# EAGLE design esp32_uart_co2_sensor (EAGLE 9.6.2)
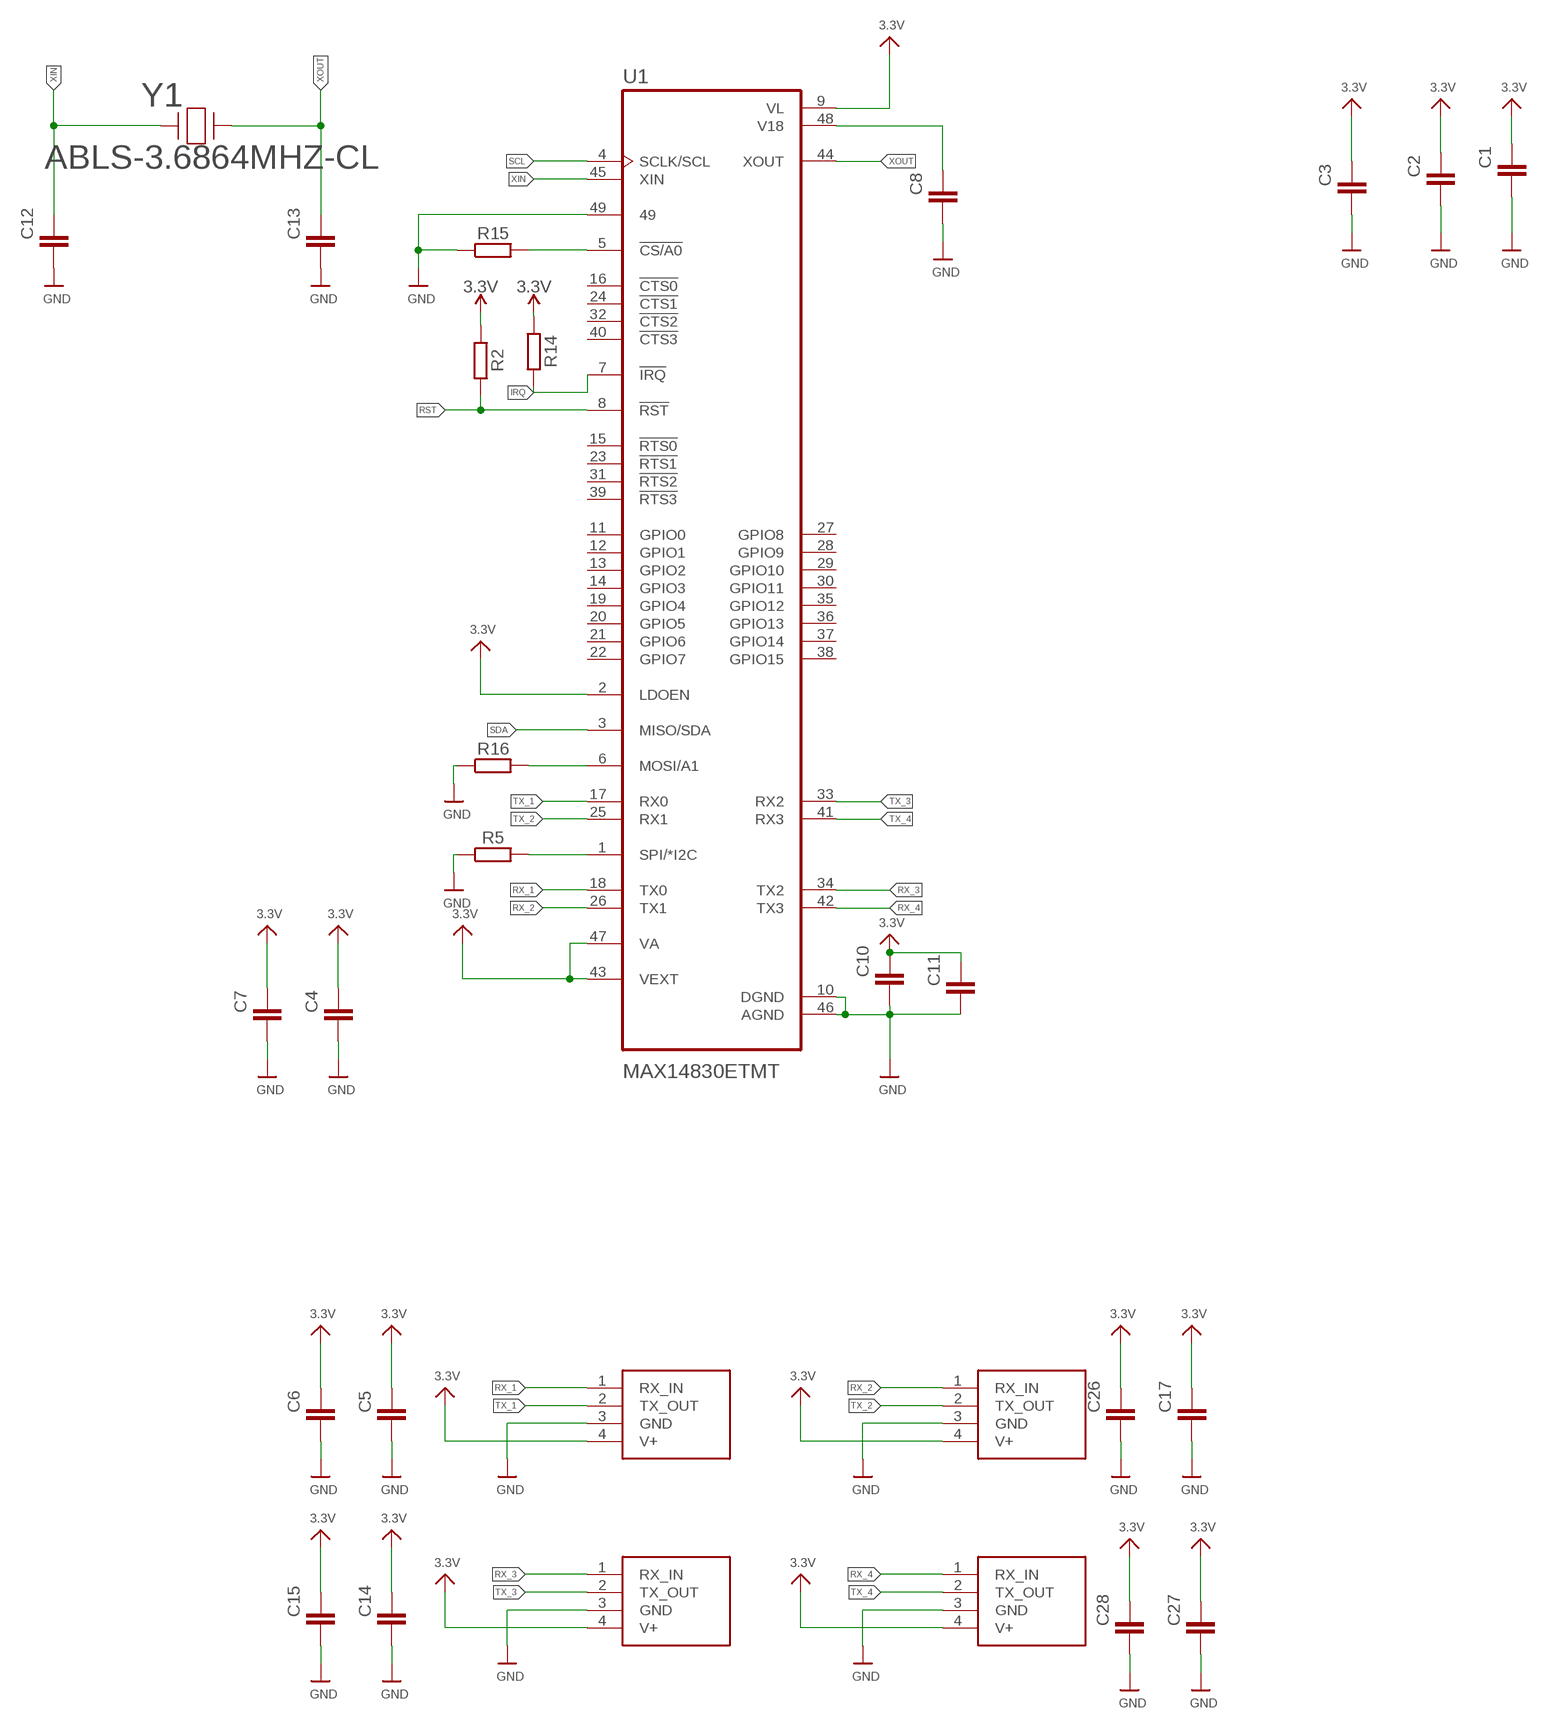
[diagram p0: schematic, sheet 1, part 1 of 2]
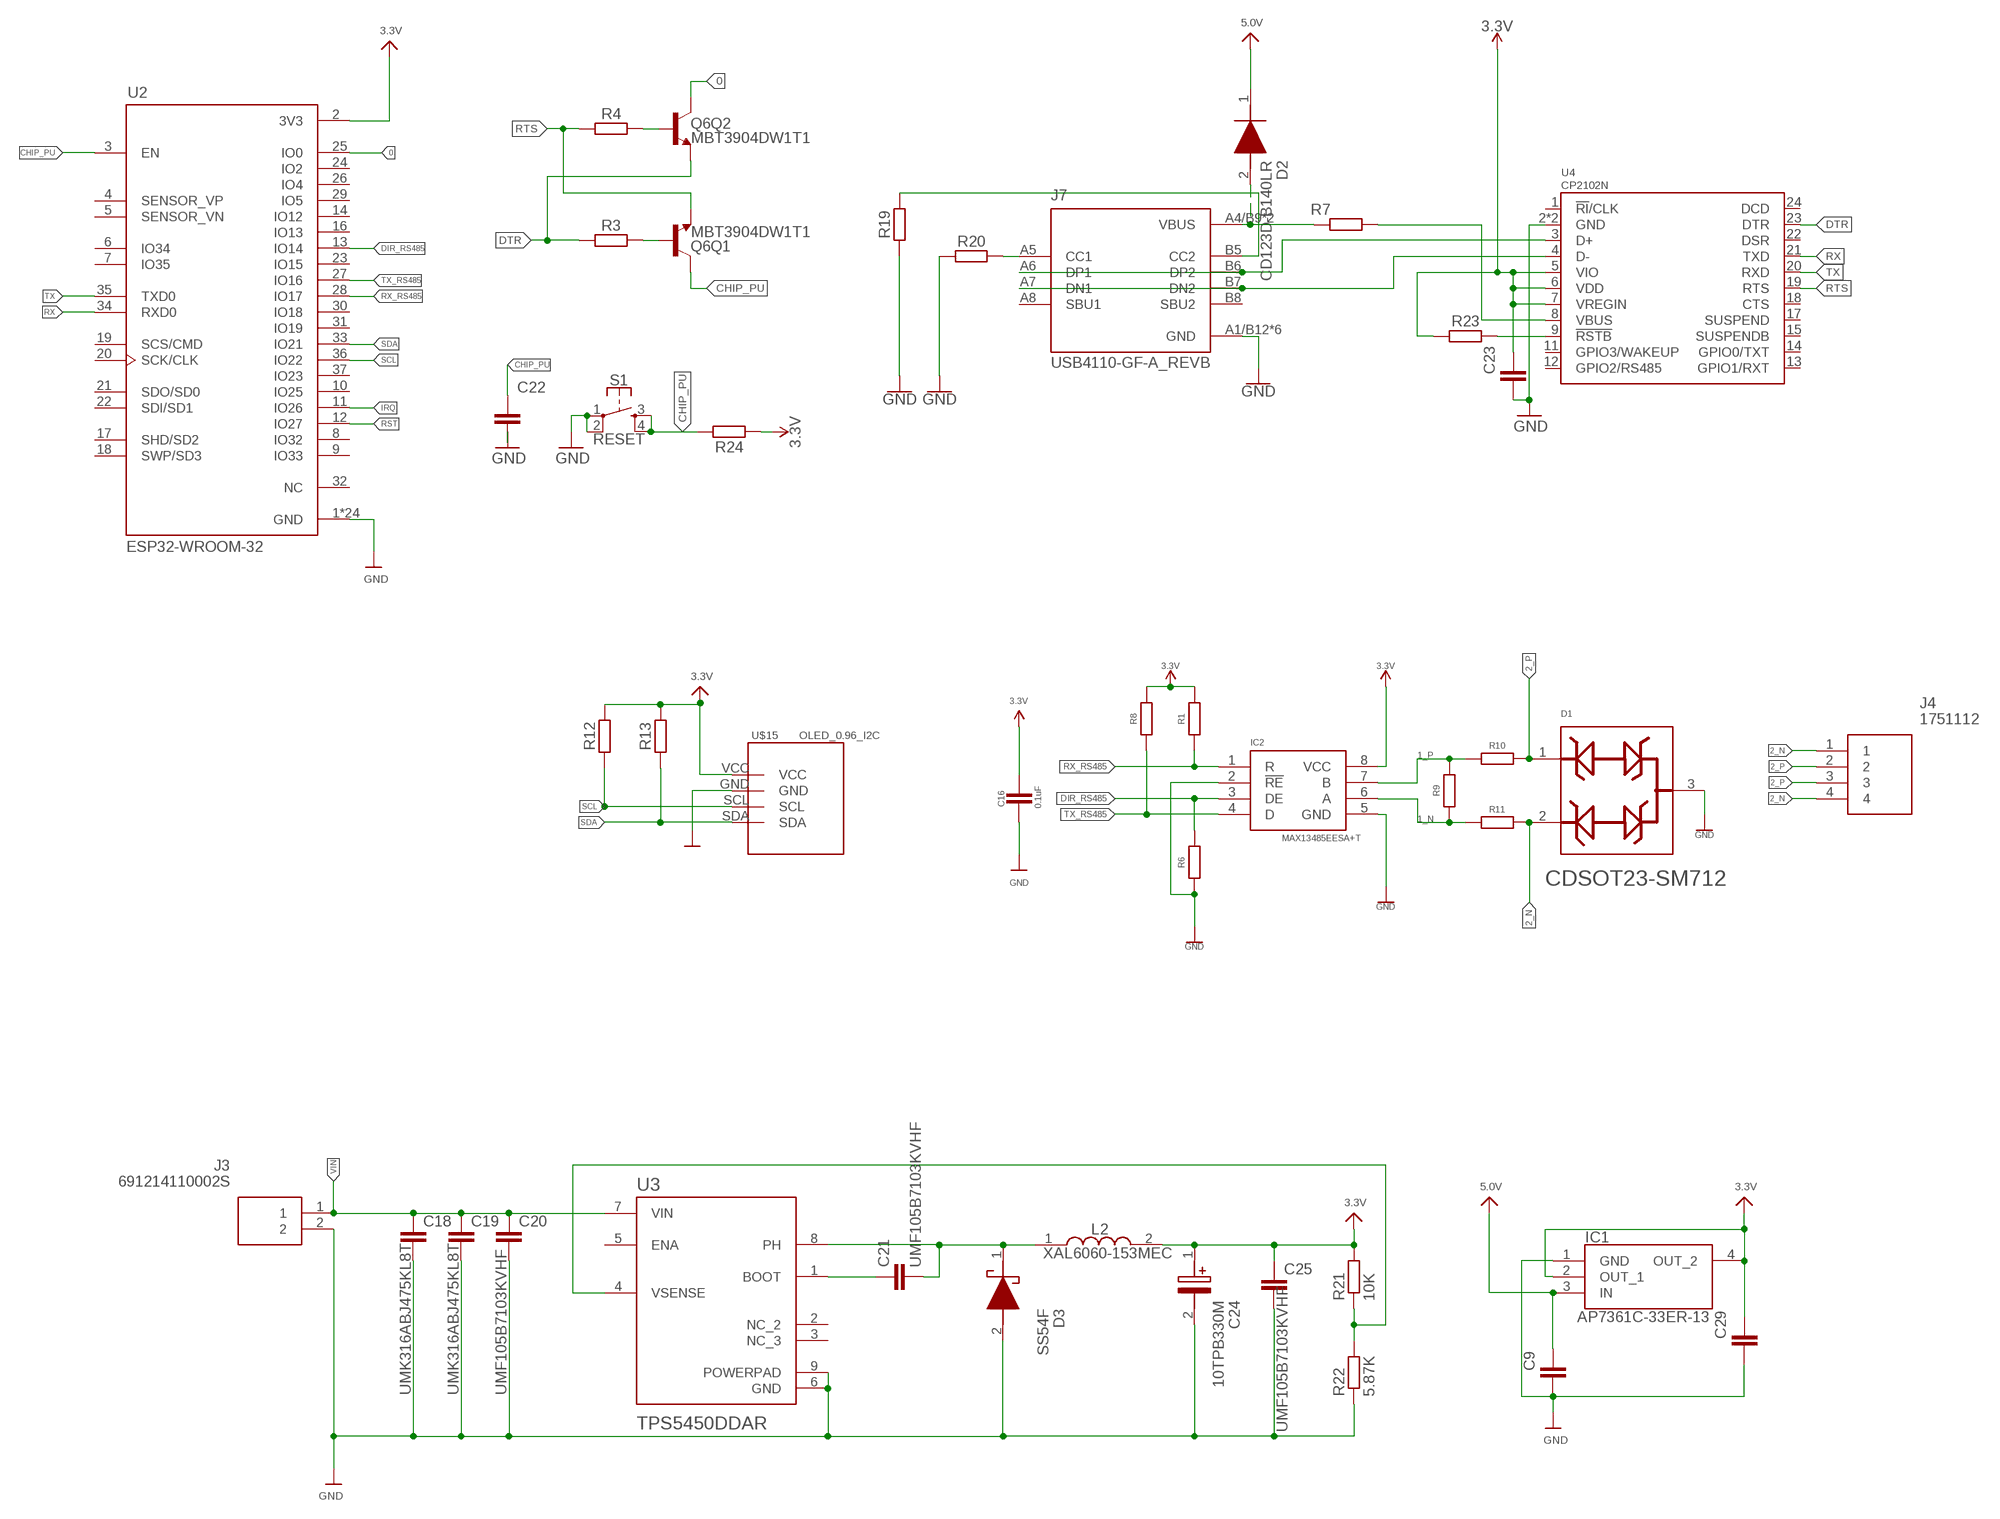
[diagram p1: schematic, sheet 1, part 2 of 2]

## Parts
C1  10uF  C-EUC0402  [C0402]
C2  0.1uF  C-EUC0402  [C0402]
C3  1uF  C-EUC0402  [C0402]
C4  1uF  C-EUC0402  [C0402]
C5  1uF  C-EUC0402  [C0402]
C6  10uF  C-EUC0402  [C0402]
C7  10uF  C-EUC0402  [C0402]
C8  1uF  C-EUC0402  [C0402]
C9  4.7uF  C-EUC0402  [C0402]
C10  1uF  C-EUC0402  [C0402]
C11  1uF  C-EUC0402  [C0402]
C12  18pF  C-EUC0402  [C0402]
C13  18pF  C-EUC0402  [C0402]
C14  1uF  C-EUC0402  [C0402]
C15  10uF  C-EUC0402  [C0402]
C16  0.1uF  0.1UF-0402T-16V-10%  [0402-TIGHT]
C17  1uF  C-EUC0402  [C0402]
C18  UMK316ABJ475KL8T  C-EUC1206  [C1206]
C19  UMK316ABJ475KL8T  C-EUC1206  [C1206]
C20  UMF105B7103KVHF  C-EUC0402  [C0402]
C21  UMF105B7103KVHF  C-EUC0402  [C0402]
C22  1.0uF  C-EUC0402  [C0402]
C23  10uF  C-EUC0402  [C0402]
C24  10TPB330M  [CAPPM7343X400N]
C25  UMF105B7103KVHF  C-EUC0402  [C0402]
C26  10uF  C-EUC0402  [C0402]
C27  1uF  C-EUC0402  [C0402]
C28  10uF  C-EUC0402  [C0402]
C29  4.7uF  C-EUC0402  [C0402]
D1  BOURNS_INC._CDSOT23-SM712BOURNS_INC._CDSOT23-SM712_0_0  [BOURNS_INC._CDSOT23-SM712_0]
D2  CD123D-B140LR  [CD123DB140LR]
D3  SS54F  [SODFL4626X130N]
IC1  AP7361C-33ER-13  [SOT230P700X180-4N]
IC2  MAX13485EESA+T  THVD1450DR  [SOIC127P600X175-8N]
J3  691214110002S  [691214110002S]
J4  1751112  [1751112]
J7  USB4110-GF-A_REVB  [GCT_USB4110-GF-A_REVB]
L2  XAL6060-153MEC  [XAL6060153MEC]
Q6  MBT3904DW1T1  TRANS_NPN_DUAL-MBT3904DW1T1  [SC70-6]
R1  2.2k  R-EU_R0402  [R0402]
R2  10k  R-EU_R0402  [R0402]
R3  10k  R-EU_R0402  [R0402]
R4  10k  R-EU_R0402  [R0402]
R5  10k  R-EU_R0402  [R0402]
R6  2.2k  R-EU_R0603  [R0603]
R7  10  R-EU_R0603  [R0603]
R8  2.2k  R-EU_R0402  [R0402]
R9  120R  R-EU_R0603  [R0603]
R10  10Ω  R-EU_R0402  [R0402]
R11  10Ω  R-EU_R0402  [R0402]
R12  10k  R-EU_R0402  [R0402]
R13  10k  R-EU_R0402  [R0402]
R14  10k  R-EU_R0402  [R0402]
R15  10k  R-EU_R0402  [R0402]
R16  10k  R-EU_R0402  [R0402]
R19  5.1k  R-EU_R0402  [R0402]
R20  5.1k  R-EU_R0402  [R0402]
R21  10K  R-EU_R0402  [R0402]
R22  5.87K  R-EU_R0402  [R0402]
R23  1k  R-EU_R0402  [R0402]
R24  10k  R-EU_R0402  [R0402]
S1  RESET  MOMENTARY-SWITCH-SPST-2-SMD-4.6X2.8MM  [TACTILE_SWITCH_SMD_4.6X2.8MM]
SEN1  SPRINTIR-6S-20  [SPRINTIR-6S-20]
SEN2  SPRINTIR-6S-20  [SPRINTIR-6S-20]
SEN3  SPRINTIR-6S-20  [SPRINTIR-6S-20]
SEN4  SPRINTIR-6S-20  [SPRINTIR-6S-20]
U1  MAX14830ETMT  [QFN50P700X700X80-49N]
U2  ESP32-WROOM-32  [MODULE_ESP32-WROOM-32]
U3  TPS5450DDAR  [CONV_TPS5450DDAR]
U4  CP2102N  [QFN24]
U$15  OLED_0.96_I2C  [OLED_0.96_I2C]
Y1  ABLS-3.6864MHZ-CL  ABLS-3.6864MHZ-CL-RESR-A-1-G-FABLS_SERIES_ABR  [ABLS_SERIES_ABR]

## Nets
0: Q6.6(Q2:C) U2.25(IO0)
1_N: IC2.6(A) R9.1 R11.1
1_P: IC2.7(B) R9.2 R10.1
2_N: D1.2 J4.1 J4.4 R11.2
2_P: D1.1 J4.2 J4.3 R10.2
3.3V: C1.1 C2.1 C3.1 C4.1 C5.1 C6.1 C7.1 C10.1 C11.1 C14.1 C15.1 C16.1 C17.1 C23.1 C24.1(+) C25.1 C26.1 C27.1 C28.1 C29.1 IC1.2(OUT_1) IC1.4(OUT_2) IC2.8(VCC) L2.2 R1.2 R2.1 R8.2 R12.2 R13.2 R14.1 R21.2 R23.1 R24.1 SEN1.4(V+) SEN2.4(V+) SEN3.4(V+) SEN4.4(V+) U1.2(LDOEN) U1.9(VL) U1.43(VEXT) U1.47(VA) U2.2(3V3) U4.5(VIO) U4.6(VDD) U4.7(VREGIN) U$15.VCC
5.0V: C9.1 D2.1(K) IC1.3(IN)
CHIP_PU: C22.1 Q6.3(Q1:C) R24.2 S1.3 S1.4 U2.3(EN)
CS: R15.2 U1.5(!CS/A0)
DIR_RS485: IC2.3(DE) R6.2 U2.13(IO14)
DTR: Q6.1(Q2:E) R3.1 U4.23(DTR)
GND: C1.2 C2.2 C3.2 C4.2 C5.2 C6.2 C7.2 C8.2 C9.2 C10.2 C11.2 C12.2 C13.2 C14.2 C15.2 C16.2 C17.2 C18.2 C19.2 C20.2 C22.2 C23.2 C24.2(-) C25.2 C26.2 C27.2 C28.2 C29.2 D1.3 D3.2(A) IC1.1(GND) IC2.2(!RE) IC2.5(GND) J3.2 J7.A1/B12(GND) J7.B1/A12(GND) J7.S1(GND) J7.S2(GND) J7.S3(GND) J7.S4(GND) R5.1 R6.1 R15.1 R16.1 R19.1 R20.1 R22.1 S1.1 S1.2 SEN1.3(GND) SEN2.3(GND) SEN3.3(GND) SEN4.3(GND) U1.10(DGND) U1.46(AGND) U1.49 U2.1(GND) U2.15(GND) U2.38(GND) U2.39_1(GND) U2.39_2(GND) U2.39_3(GND) U2.39_4(GND) U2.39_5(GND) U2.39_6(GND) U2.39_7(GND) U2.39_8(GND) U2.39_9(GND) U2.39_10(GND) U2.39_11(GND) U2.39_12(GND) U2.39_13(GND) U2.39_14(GND) U2.39_15(GND) U2.39_16(GND) U2.39_17(GND) U2.39_18(GND) U2.39_19(GND) U2.39_20(GND) U2.39_21(GND) U3.6(GND) U3.9(POWERPAD) U4.2(GND) U4.PAD(GND) U$15.GND
IRQ: R14.2 U1.7(!IRQ) U2.11(IO26)
N$1: C8.1 U1.48(V18)
N$2: R16.2 U1.6(MOSI/A1)
N$5: R5.2 U1.1(SPI/*I2C)
N$10: J7.A6(DP1) J7.B6(DP2) U4.3(D+)
N$11: J7.A7(DN1) J7.B7(DN2) U4.4(D-)
N$12: J7.A5(CC1) R20.2
N$13: J7.B5(CC2) R19.2
N$14: C21.1 U3.1(BOOT)
N$15: C21.2 D3.1(K) L2.1 U3.8(PH)
N$16: D2.2(A) J7.A4/B9(VBUS) J7.B4/A9(VBUS) R7.1
N$17: R21.1 R22.2 U3.4(VSENSE)
N$18: Q6.5(Q1:B) R3.2
N$21: Q6.2(Q2:B) R4.2
N$23: R23.2 U4.9(!RSTB)
N$24: R7.2 U4.8(VBUS)
RST: R2.2 U1.8(!RST) U2.12(IO27)
RTS: Q6.4(Q1:E) R4.1 U4.19(RTS)
RX: U2.34(RXD0) U4.21(TXD)
RX_1: SEN1.1(RX_IN) U1.18(TX0)
RX_2: SEN2.1(RX_IN) U1.26(TX1)
RX_3: SEN3.1(RX_IN) U1.34(TX2)
RX_4: SEN4.1(RX_IN) U1.42(TX3)
RX_RS485: IC2.1(R) R1.1 U2.28(IO17)
SCL: R12.1 U1.4(SCLK/SCL) U2.36(IO22) U$15.SCL
SDA: R13.1 U1.3(MISO/SDA) U2.33(IO21) U$15.SDA
TX: U2.35(TXD0) U4.20(RXD)
TX_1: SEN1.2(TX_OUT) U1.17(RX0)
TX_2: SEN2.2(TX_OUT) U1.25(RX1)
TX_3: SEN3.2(TX_OUT) U1.33(RX2)
TX_4: SEN4.2(TX_OUT) U1.41(RX3)
TX_RS485: IC2.4(D) R8.1 U2.27(IO16)
VIN: C18.1 C19.1 C20.1 J3.1 U3.7(VIN)
XIN: C12.1 U1.45(XIN) Y1.1
XOUT: C13.1 U1.44(XOUT) Y1.2
Unconnected: J7.A8(SBU1) J7.B8(SBU2) U1.11(GPIO0) U1.12(GPIO1) U1.13(GPIO2) U1.14(GPIO3) U1.15(!RTS0) U1.16(!CTS0) U1.19(GPIO4) U1.20(GPIO5) U1.21(GPIO6) U1.22(GPIO7) U1.23(!RTS1) U1.24(!CTS1) U1.27(GPIO8) U1.28(GPIO9) U1.29(GPIO10) U1.30(GPIO11) U1.31(!RTS2) U1.32(!CTS2) U1.35(GPIO12) U1.36(GPIO13) U1.37(GPIO14) U1.38(GPIO15) U1.39(!RTS3) U1.40(!CTS3) U2.4(SENSOR_VP) U2.5(SENSOR_VN) U2.6(IO34) U2.7(IO35) U2.8(IO32) U2.9(IO33) U2.10(IO25) U2.14(IO12) U2.16(IO13) U2.17(SHD/SD2) U2.18(SWP/SD3) U2.19(SCS/CMD) U2.20(SCK/CLK) U2.21(SDO/SD0) U2.22(SDI/SD1) U2.23(IO15) U2.24(IO2) U2.26(IO4) U2.29(IO5) U2.30(IO18) U2.31(IO19) U2.32(NC) U2.37(IO23) U3.2(NC_2) U3.3(NC_3) U3.5(ENA) U4.1(!RI!/CLK) U4.11(GPIO3/WAKEUP) U4.12(GPIO2/RS485) U4.13(GPIO1/RXT) U4.14(GPIO0/TXT) U4.15(SUSPENDB) U4.17(SUSPEND) U4.18(CTS) U4.22(DSR) U4.24(DCD)

## Library data of the parts
C1-C15 C17-C23 C25-C29 = rcl:C-EU: CAPACITOR, European symbol; SPICEPREFIX: C
C16 = SparkFun-Capacitors:0.1UF: 0.1µF ceramic capacitors A capacitor is a passive two-terminal electrical component used to store electrical energy temporarily in an electric field.; PROD_ID: CAP-12416
C24 = SamacSys_Parts:10TPB330M: Panasonic 330uF SMD Solid Polymer Tantalum Capacitor, 10 V +/-20%, POSCAP Series Source: Datasheet <http://uk.rs-online.com/web/p/products/1038644>; ARROW_PART_NUMBER: 10TPB330M; ARROW_PRICE-STOCK: https://www.arrow.com/en/products/10tpb330m/panasonic?region=nac; DESCRIPTION: Panasonic 330uF SMD Solid Polymer Tantalum Capacitor, 10 V +/-20%, POSCAP Series; HEIGHT: 4mm; MANUFACTURER_NAME: Panasonic; MANUFACTURER_PART_NUMBER: 10TPB330M; MOUSER_PART_NUMBER: 667-10TPB330M; MOUSER_PRICE-STOCK: https://www.mouser.co.uk/ProductDetail/Panasonic/10TPB330M?qs=OE1iw1LrrPGJ%2FhG9UwG4gg%3D%3D
D1 = untitled:BOURNS_INC._CDSOT23-SM712: 26V, 14V Clamp 17A (8/20µs) Ipp Tvs Diode Surface Mount SOT-23-3; AUTOMOTIVE: No; BREAKDOWN_VOLTAGE: 7.5V; CAPACITANCE: 75pF; CENTROID_NOT_SPECIFIED: No; CLAMPING_VOLTAGE: 26V; DATASHEET: https://www.bourns.com/docs/Product-Datasheets/CDSOT23-SM712.pdf; DEVICE_CLASS_L1: Circuit Protection; DEVICE_CLASS_L2: TVS Diodes; DEVICE_CLASS_L3: unset; DIGIKEY_DESCRIPTION: DIODE TVS DIODE 7V/12V 14V/26V SOT23-3; DIGIKEY_PART_NUMBER: CDSOT23-SM712CT-ND; DIRECTION: Bidirectional; FOOTPRINT_PARAMETERS_1: {"fp_type":"SOT23","params":{"N":{"default":"3","long name":"Number of leads","type":"multichoice","short name":"N"},"A":{"nom":false,"long name":"Height","min":890000,"max":1170000,"short name":"A","type":"measurement"},"A1":{"nom":false,"long name":"Package clearance","min":50000,"max":150000,"short name":"A1","type":"measurement"},"A2":{"nom":false,"long name":"Package height","min":false,"max":1120000,"short name":"A2","type":"measurement"},"D":{"nom":false,"long name":"Package length","min":2800000,"max":3000000,"short name":"D","type":"measurement"},"E":{"nom":false,"long name":"Width /w leads","min":2100000,"max":2490000,"short name":"E","type":"measurement"},"E1":{"nom":false,"long name":"Package width","min":1200000,"max":1400000,"short name":"E1","type":"measurement"},"B":{"nom":false,"long name":"Lead width","min":300000,"max":500000,"short name":"B","type":"measurement"},"C":{"nom":false,"long name":"Lead thickness","min":80000,"max":200000,"short name":"C","type":"measurement"},"L":{"nom":false,"long name":"Lead foot length","min":400000,"max":580000,"short name":"L","type":"measurement"},"e":{"nom":950000,"long name":"Lead pitch","min":null,"max":null,"short name":"e","type":"measurement"},"PHI":{"nom":false,"long name":"Lead angle","min":0,"max":8,"short name":"PHI","type":"measurement"},"offset x":{"nom":0,"long name":"X Center offset","min":null,"max":null,"short name":"offset x","type":"measurement"},"offset y":{"nom":0,"long name":"Y Center offset","min":null,"max":null,"short name":"offset y","type":"measurement"},"LS":{"default":"Rounded rectangle","long name":"Land shape","type":"multichoice","short name":"LS"},"LS1":{"default":"Rectangle","long name":"Land shape (Pin 1)","type":"multichoice","short name":"LS1"},"solder toe":{"nom":550000,"long name":"Solder fillet (toe)","min":null,"max":null,"short name":"solder toe","type":"fixedmeasurement"},"solder heel":{"nom":450000,"long name":"Solder fillet (heel)","min":null,"max":null,"short name":"solder heel","type":"fixedmeasurement"},"solder side":{"nom":50000,"long name":"Solder fillet (side)","min":null,"max":null,"short name":"solder side","type":"fixedmeasurement"},"courtyard":{"nom":500000,"long name":"Courtyard","min":null,"max":null,"short name":"courtyard","type":"fixedmeasurement"},"SF":{"default":"A","long name":"Packing level","type":"multichoiceparent","short name":"SF","help":"http://support.upverter.com/customer/portal/articles/978783-what-is-a-footprint-packing-level","children":["solder toe","solder heel","solder side","courtyard"]}}}; FOOTPRINT_PARAMETERS_2: {"fp_type":"SOT23","params":{"N":{"default":"3","long name":"Number of leads","type":"multichoice","short name":"N"},"A":{"nom":false,"long name":"Height","min":890000,"max":1170000,"short name":"A","type":"measurement"},"A1":{"nom":false,"long name":"Package clearance","min":50000,"max":150000,"short name":"A1","type":"measurement"},"A2":{"nom":false,"long name":"Package height","min":false,"max":1120000,"short name":"A2","type":"measurement"},"D":{"nom":false,"long name":"Package length","min":2800000,"max":3000000,"short name":"D","type":"measurement"},"E":{"nom":false,"long name":"Width /w leads","min":2100000,"max":2490000,"short name":"E","type":"measurement"},"E1":{"nom":false,"long name":"Package width","min":1200000,"max":1400000,"short name":"E1","type":"measurement"},"B":{"nom":false,"long name":"Lead width","min":300000,"max":500000,"short name":"B","type":"measurement"},"C":{"nom":false,"long name":"Lead thickness","min":80000,"max":200000,"short name":"C","type":"measurement"},"L":{"nom":false,"long name":"Lead foot length","min":400000,"max":580000,"short name":"L","type":"measurement"},"e":{"nom":950000,"long name":"Lead pitch","min":null,"max":null,"short name":"e","type":"measurement"},"PHI":{"nom":false,"long name":"Lead angle","min":0,"max":8,"short name":"PHI","type":"measurement"},"offset x":{"nom":0,"long name":"X Center offset","min":null,"max":null,"short name":"offset x","type":"measurement"},"offset y":{"nom":0,"long name":"Y Center offset","min":null,"max":null,"short name":"offset y","type":"measurement"},"LS":{"default":"Rounded rectangle","long name":"Land shape","type":"multichoice","short name":"LS"},"LS1":{"default":"Rectangle","long name":"Land shape (Pin 1)","type":"multichoice","short name":"LS1"},"solder toe":{"nom":350000,"long name":"Solder fillet (toe)","min":null,"max":null,"short name":"solder toe","type":"fixedmeasurement"},"solder heel":{"nom":350000,"long name":"Solder fillet (heel)","min":null,"max":null,"short name":"solder heel","type":"fixedmeasurement"},"solder side":{"nom":30000,"long name":"Solder fillet (side)","min":null,"max":null,"short name":"solder side","type":"fixedmeasurement"},"courtyard":{"nom":250000,"long name":"Courtyard","min":null,"max":null,"short name":"courtyard","type":"fixedmeasurement"},"SF":{"default":"B","long name":"Packing level","type":"multichoiceparent","short name":"SF","help":"http://support.upverter.com/customer/portal/articles/978783-what-is-a-footprint-packing-level","children":["solder toe","solder heel","solder side","courtyard"]}}}; FOOTPRINT_PARAMETERS_3: {"fp_type":"SOT23","params":{"N":{"default":"3","long name":"Number of leads","type":"multichoice","short name":"N"},"A":{"nom":false,"long name":"Height","min":890000,"max":1170000,"short name":"A","type":"measurement"},"A1":{"nom":false,"long name":"Package clearance","min":50000,"max":150000,"short name":"A1","type":"measurement"},"A2":{"nom":false,"long name":"Package height","min":false,"max":1120000,"short name":"A2","type":"measurement"},"D":{"nom":false,"long name":"Package length","min":2800000,"max":3000000,"short name":"D","type":"measurement"},"E":{"nom":false,"long name":"Width /w leads","min":2100000,"max":2490000,"short name":"E","type":"measurement"},"E1":{"nom":false,"long name":"Package width","min":1200000,"max":1400000,"short name":"E1","type":"measurement"},"B":{"nom":false,"long name":"Lead width","min":300000,"max":500000,"short name":"B","type":"measurement"},"C":{"nom":false,"long name":"Lead thickness","min":80000,"max":200000,"short name":"C","type":"measurement"},"L":{"nom":false,"long name":"Lead foot length","min":400000,"max":580000,"short name":"L","type":"measurement"},"e":{"nom":950000,"long name":"Lead pitch","min":null,"max":null,"short name":"e","type":"measurement"},"PHI":{"nom":false,"long name":"Lead angle","min":0,"max":8,"short name":"PHI","type":"measurement"},"offset x":{"nom":0,"long name":"X Center offset","min":null,"max":null,"short name":"offset x","type":"measurement"},"offset y":{"nom":0,"long name":"Y Center offset","min":null,"max":null,"short name":"offset y","type":"measurement"},"LS":{"default":"Rounded rectangle","long name":"Land shape","type":"multichoice","short name":"LS"},"LS1":{"default":"Rectangle","long name":"Land shape (Pin 1)","type":"multichoice","short name":"LS1"},"solder toe":{"nom":150000,"long name":"Solder fillet (toe)","min":null,"max":null,"short name":"solder toe","type":"fixedmeasurement"},"solder heel":{"nom":250000,"long name":"Solder fillet (heel)","min":null,"max":null,"short name":"solder heel","type":"fixedmeasurement"},"solder side":{"nom":10000,"long name":"Solder fillet (side)","min":null,"max":null,"short name":"solder side","type":"fixedmeasurement"},"courtyard":{"nom":100000,"long name":"Courtyard","min":null,"max":null,"short name":"courtyard","type":"fixedmeasurement"},"SF":{"default":"C","long name":"Packing level","type":"multichoiceparent","short name":"SF","help":"http://support.upverter.com/customer/portal/articles/978783-what-is-a-footprint-packing-level","children":["solder toe","solder heel","solder side","courtyard"]}}}; FOOTPRINT_VARIANT_NAME_0: Recommended_Land_Pattern; FOOTPRINT_VARIANT_NAME_1: IPC_A; FOOTPRINT_VARIANT_NAME_2: IPC_B; FOOTPRINT_VARIANT_NAME_3: IPC_C; HEIGHT: 1.17mm; IPC_LAND_PATTERN_NAME: SOT95P229X103-3; LEAD_FREE: Yes; MF: Bourns Inc.; MFG_PACKAGE_IDENT: SOT23; MFG_PACKAGE_IDENT_DATE: 0; MFG_PACKAGE_IDENT_REV: 0; MOUSER_DESCRIPTION: Transient Voltage Suppressor, TVS, CDSOT23 Series, Unidirectional, 12 V, SOT-23, 3, 13.3 V; MOUSER_PART_NUMBER: 652-CDSOT23-SM712; MPN: CDSOT23-SM712; NUMBER_OF_CHANNELS: 2; PACKAGE: SOT23-3; PEAK_PULSE_CURRENT: 17A; PEAK_PULSE_POWER: 400W; PREFIX: D; REVERSE_STANDOFF_VOLTAGE: 12V; ROHS: Yes; STANDOFF_HEIGHT: 0.05mm; TEMPERATURE_RANGE_HIGH: +150°C; TEMPERATURE_RANGE_LOW: -55°C; VERIFICATION_VERSION: 0.0.0.3
D2 = SamacSys_Parts:CD123D-B140LR: BOURNS - CD123D-B140LR - Small Signal Schottky Diode, Single, 40 V, 1 A, 380 mV, 20 A, 125 C Source: Datasheet <https://www.bourns.com/docs/product-datasheets/cd123d-b.pdf?sfvrsn=54b574f6_7>; ARROW_PART_NUMBER: CD123D-B140LR; ARROW_PRICE-STOCK: https://www.arrow.com/en/products/cd123d-b140lr/bourns?region=nac; DESCRIPTION: BOURNS - CD123D-B140LR - Small Signal Schottky Diode, Single, 40 V, 1 A, 380 mV, 20 A, 125 C; HEIGHT: 1.16mm; MANUFACTURER_NAME: Bourns; MANUFACTURER_PART_NUMBER: CD123D-B140LR; MOUSER_PART_NUMBER: 652-CD123D-B140LR; MOUSER_PRICE-STOCK: https://www.mouser.co.uk/ProductDetail/Bourns/CD123D-B140LR?qs=xhbEVWpZdWeACvF%2F8gDRTg%3D%3D
D3 = SamacSys_Parts:SS54F: SURFACE MOUNT SCHOTTKY BARRIER RECTIFIER Source: Datasheet <https://datasheet.lcsc.com/szlcsc/1903042031_MDD-Jiangsu-Yutai-Elec-SS54F_C64882.pdf>; DESCRIPTION: SURFACE MOUNT SCHOTTKY BARRIER RECTIFIER; HEIGHT: 1.3mm; MANUFACTURER_NAME: MDDMicrodiode Electronics; MANUFACTURER_PART_NUMBER: SS54F
IC1 = SamacSys_Parts:AP7361C-33ER-13: 1A LOW DROPOUT ADJUSTABLE AND FIXED-MODE REGULATOR WITH ENABLE Source: Datasheet <https://componentsearchengine.com/Datasheets/1/AP7361C-33ER-13.pdf>; ARROW_PART_NUMBER: AP7361C-33ER-13; ARROW_PRICE-STOCK: https://www.arrow.com/en/products/ap7361c-33er-13/diodes-incorporated; DESCRIPTION: 1A LOW DROPOUT ADJUSTABLE AND FIXED-MODE REGULATOR WITH ENABLE; HEIGHT: 1.8mm; MANUFACTURER_NAME: Diodes Inc.; MANUFACTURER_PART_NUMBER: AP7361C-33ER-13; MOUSER_PART_NUMBER: 621-AP7361C-33ER-13; MOUSER_PRICE-STOCK: https://www.mouser.co.uk/ProductDetail/Diodes-Incorporated/AP7361C-33ER-13?qs=60RJRzIpcl8A1pMqYmc7oA%3D%3D
IC2 = untitled:THVD1450DR: 3.3-V to 5-V RS-485 Transceivers With +/-16-kV IEC ESD Protection Source: Datasheet <http://www.ti.com/lit/gpn/thvd1450>; ARROW_PART_NUMBER: THVD1450DR; ARROW_PRICE-STOCK: https://www.arrow.com/en/products/thvd1450dr/texas-instruments?region=nac; DESCRIPTION: 3.3-V to 5-V RS-485 Transceivers With +/-16-kV IEC ESD Protection; HEIGHT: 1.75mm; MANUFACTURER_NAME: Texas Instruments; MANUFACTURER_PART_NUMBER: THVD1450DR; MOUSER_PART_NUMBER: 595-THVD1450DR; MOUSER_PRICE-STOCK: https://www.mouser.co.uk/ProductDetail/Texas-Instruments/THVD1450DR?qs=chTDxNqvsymGDnwVnRgduw%3D%3D
J3 = SamacSys_Parts:691214110002S: Fixed Terminal Blocks Horizontal 3.50mm CAGE CLAMP - WR-TBL Source: Datasheet <https://katalog.we-online.de/em/datasheet/6912141100xx.pdf>; DESCRIPTION: Fixed Terminal Blocks Horizontal 3.50mm CAGE CLAMP - WR-TBL; HEIGHT: 8.7mm; MANUFACTURER_NAME: Wurth Elektronik; MANUFACTURER_PART_NUMBER: 691214110002S; MOUSER_PART_NUMBER: 710-691214110002S; MOUSER_PRICE-STOCK: https://www.mouser.co.uk/ProductDetail/Wurth-Elektronik/691214110002S?qs=w%2Fv1CP2dgqrp3US926hqig%3D%3D
J4 = SamacSys_Parts:1751112: PCB terminal block, nominal current: 10 A, rated voltage (III/2): 200 V, nominal cross section: 1 mm?, Number of potentials: 4, Number of rows: 1, Number of positions per row: 4, product range: SMKDS 1, pitch: 3.5 mm, connection method: Screw connection with tension sleeve, mounting: Wave soldering, conductor/PCB connection direction: 35 ?, color: green, Pin layout: Linear pinning, Solder pin [P]: 3.5 mm, type of packaging: packed in cardboard Source: Datasheet <http://www.phoenixcontact.com/de/produkte/1751112/pdf>; ARROW_PART_NUMBER: 1751112; ARROW_PRICE-STOCK: https://www.arrow.com/en/products/1751112/phoenix-contact?region=nac; DESCRIPTION: PCB terminal block, nominal current: 10 A, rated voltage (III/2): 200 V, nominal cross section: 1 mm?, Number of potentials: 4, Number of rows: 1, Number of positions per row: 4, product range: SMKDS 1, pitch: 3.5 mm, connection method: Screw connection with tension sleeve, mounting: Wave soldering, conductor/PCB connection direction: 35 ?, color: green, Pin layout: Linear pinning, Solder pin [P]: 3.5 mm, type of packaging: packed in cardboard; HEIGHT: 11.17mm; MANUFACTURER_NAME: Phoenix Contact; MANUFACTURER_PART_NUMBER: 1751112; MOUSER_PART_NUMBER: 651-1751112; MOUSER_PRICE-STOCK: https://www.mouser.co.uk/ProductDetail/Phoenix-Contact/1751112?qs=nq%2FEIFkB2fFa%252BWXlXQy39Q%3D%3D
J7 = USB4110-GF-A_REVB:USB4110-GF-A_REVB: Check prices <https://pricing.snapeda.com/parts/USB4110-GF-A/GCT/view-part?ref=eda>; AVAILABILITY: In Stock; DESCRIPTION: USB-C (USB TYPE-C) USB 2.0 Receptacle Connector 24 (16+8 Dummy) Position Surface Mount, Right Angle; Through Hole; MF: GCT; MP: USB4110-GF-A; PACKAGE: None; PRICE: None
L2 = SamacSys_Parts:XAL6060-153MEC: COILCRAFT - XAL6060-153MEC - INDUCTOR, 15UH, 6A, 20%, PWR, 11MHZ Source: Datasheet <https://www.coilcraft.com/pdfs/xal60xx.pdf>; DESCRIPTION: COILCRAFT - XAL6060-153MEC - INDUCTOR, 15UH, 6A, 20%, PWR, 11MHZ; HEIGHT: mm; MANUFACTURER_NAME: COILCRAFT; MANUFACTURER_PART_NUMBER: XAL6060-153MEC; MOUSER_PART_NUMBER: 994-XAL6060-153MEC; MOUSER_PRICE-STOCK: https://www.mouser.co.uk/ProductDetail/Coilcraft/XAL6060-153MEC?qs=zCSbvcPd3pYHXGDXbm%2FWuA%3D%3D
Q6 = SparkFun-DiscreteSemi:TRANS_NPN_DUAL: Dual NPN Transistors in Single Package The MBT3904W1 puts two general purpose 3904 NPN transistors in a single package. Datasheet <http://www.onsemi.com/pub_link/Collateral/MBT3904DW1T1-D.PDF> SparkFun Products: SparkFun ESP32 Thing <https://www.sparkfun.com/products/13907>; PROD_ID: TRANS-13337
R1-R16 R19-R24 = rcl:R-EU_: RESISTOR, European symbol; SPICEPREFIX: R
S1 = SparkFun-Switches:MOMENTARY-SWITCH-SPST-2: Momentary Switch (Pushbutton) - SPST - Two Circuits Normally-open (NO) SPST momentary switches (buttons, pushbuttons). Schematic symbol includes two switch circuits. Variants SMD-4.6MMX2.8MM - 4.60mm x 2.80mm Tactile Momentary Button Switch - Used on SparkFun SAMD21 Mini Breakout <https://www.sparkfun.com/products/13664> SMD-5.2MM - Mini Pushbutton Switch - SMD <https://www.sparkfun.com/products/8720> - Used on Arduino Pro Mini <https://www.sparkfun.com/products/11114>; PROD_ID: SWCH-13065
SEN1-SEN4 = SprintIR:SPRINTIR-6S-20
U1 = MAX14830ETMT:MAX14830ETMT: Check availability <https://pricing.snapeda.com/parts/MAX14830ETM%2B/Maxim%20Integrated/view-part?ref=eda>; AVAILABILITY: In Stock; DESCRIPTION: UART IC 4, QUART Channel RS232, RS485 128 Byte 48-TQFN (7x7); MF: Maxim Integrated; MP: MAX14830ETM+; PACKAGE: TQFN-48 Maxim; PRICE: None; PURCHASE-URL: https://pricing.snapeda.com/search/part/MAX14830ETM+/?ref=eda
U2 = ESP32-WROOM-32 (1):ESP32-WROOM-32: Check availability <https://pricing.snapeda.com/parts/ESP32-WROOM-32/Espressif%20Systems/view-part?ref=eda>; AVAILABILITY: In Stock; DESCRIPTION: Bluetooth, WiFi 802.11b/g/n, Bluetooth v4.2 +EDR, Class 1, 2 and 3 Transceiver Module 2.4GHz ~ 2.5GHz Antenna Not Included, U.FL Surface Mount; MF: Espressif Systems; MP: ESP32-WROOM-32; PACKAGE: Module Espressif Systems; PRICE: None; PURCHASE-URL: https://pricing.snapeda.com/search/part/ESP32-WROOM-32/?ref=eda
U3 = TPS5450DDAR:TPS5450DDAR: 5.5V to 36V Input, 5A, 500kHz Step Down Converter 8-SO PowerPAD -40 to 125 Check prices <https://pricing.snapeda.com/parts/TPS5450DDAR/Texas%20Instruments/view-part?ref=eda>; AVAILABILITY: In Stock; DESCRIPTION: 5.5V to 36V Input, 5A, 500kHz Step Down Converter 8-SO PowerPAD -40 to 125; MF: Texas Instruments; MP: TPS5450DDAR; PACKAGE: HSOIC-8 Texas Instruments; PRICE: None; PURCHASE-URL: https://pricing.snapeda.com/search/part/TPS5450DDAR/?ref=eda
U4 = SparkFun-IC-Comms:CP2102N; PROD_ID: IC-14020
U$15 = tft_1_8_1_44_oled_0_96:OLED_0.96_I2C
Y1 = crystal:ABLS-3.6864MHZ-CL-RESR-A-1-G-F; COPYRIGHT: Copyright (C) 2022 Ultra Librarian. All rights reserved.; MANUFACTURER_PART_NUMBER: ABLS-3.6864MHZ-CL-RESR-A-1-G-F; MFR_NAME: Abracon

## Board
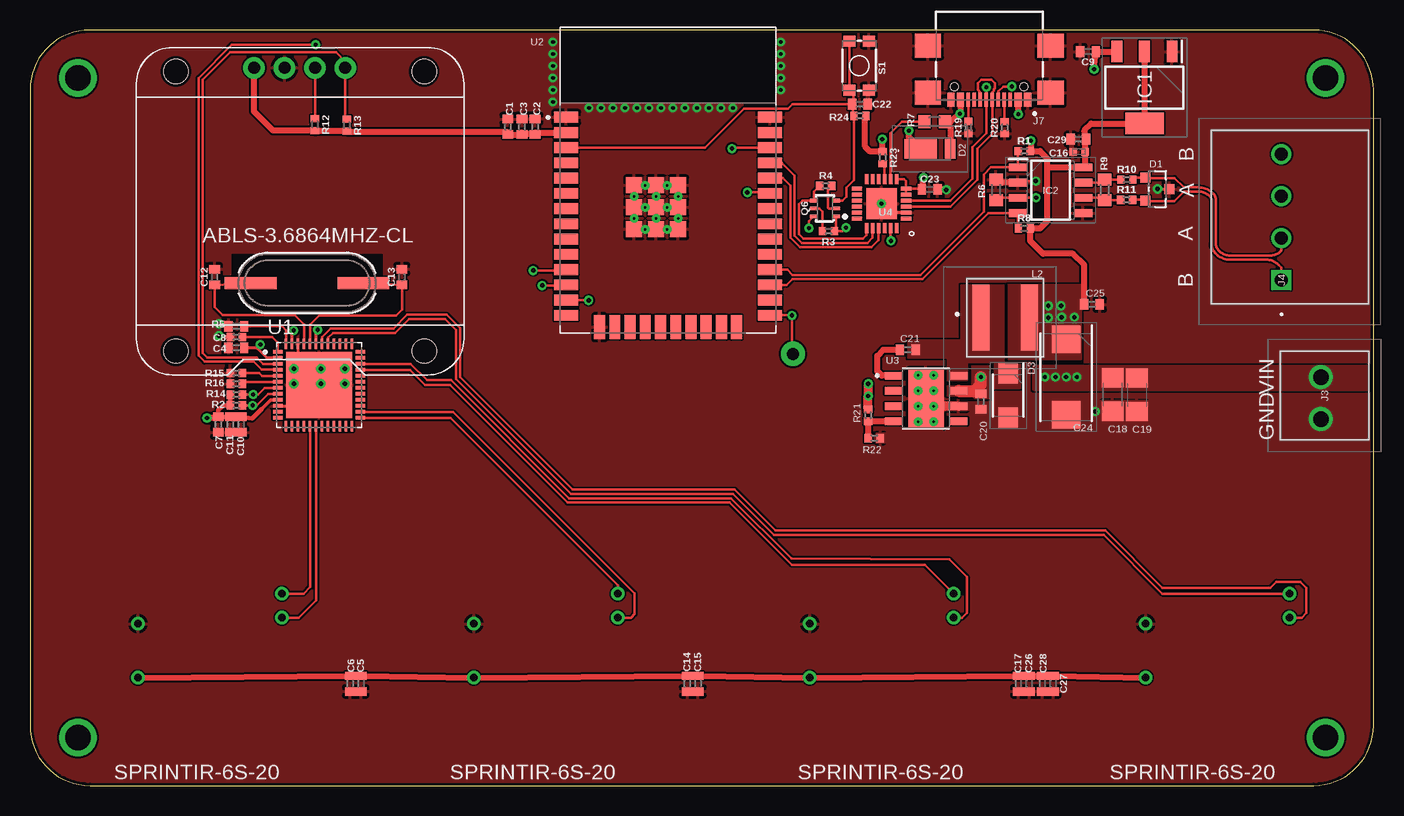
[diagram p2: board, top side]
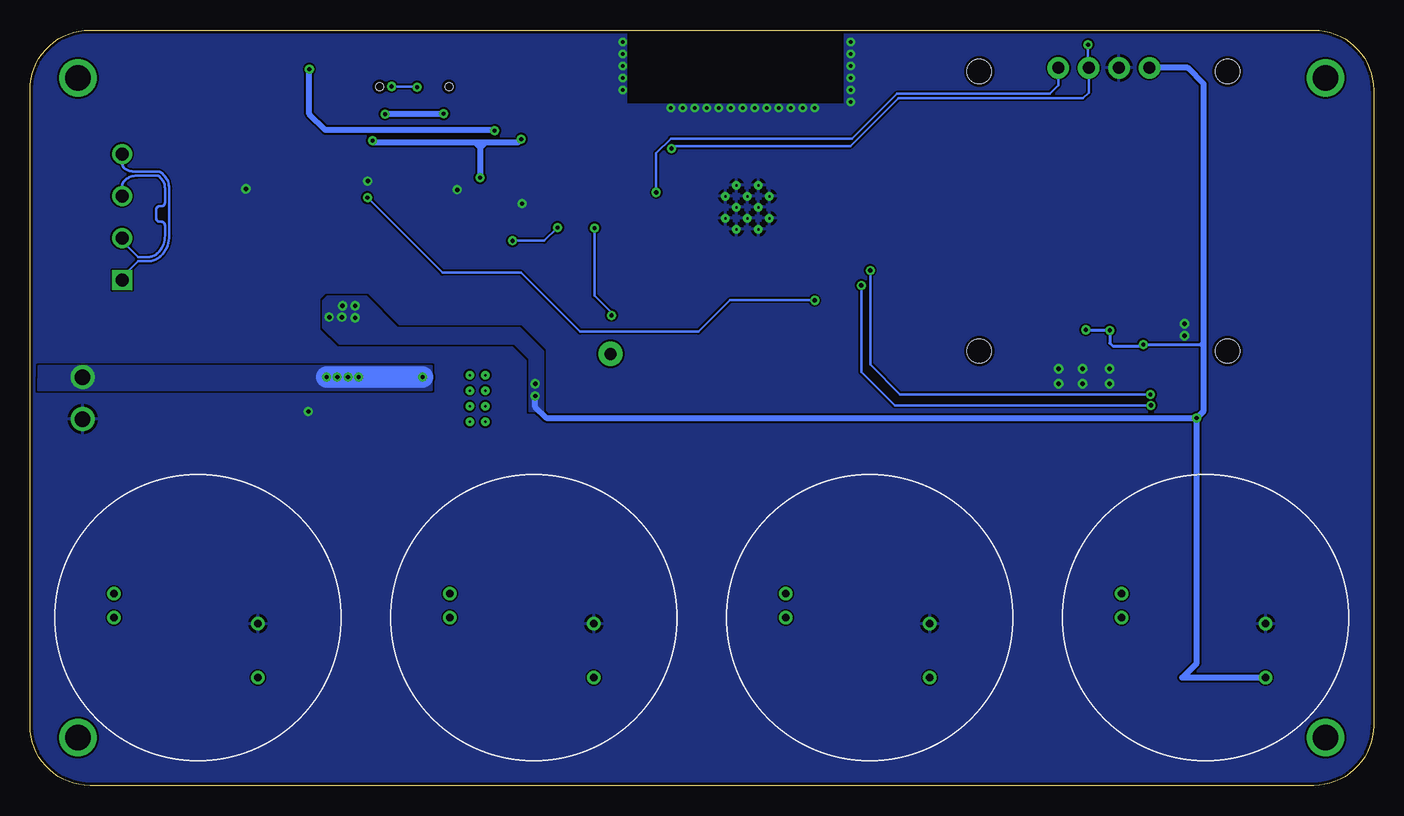
[diagram p3: board, bottom side, seen from below]

Size 112 x 63 mm. Coordinates in mm from the lower left corner, seen from the top.
Outline: 5,0 107,0 arc90 112,5 112,58 arc90 107,63 5,63 arc90 0,58 0,5 arc90 5,0
Copper layers (1*16): Top 0.035mm / dielectric 1.5mm / Bottom 0.035mm
Design rules "default *": minimum track width 6mil, minimum drill 0.35mm, track to track 6mil, track to pad 6mil, pad to pad 6mil, via to via 6mil, smd to smd 6mil, copper to edge 10mil, drill to drill 6mil, minimum pad ring 10mil, minimum via ring 8mil, stop-mask expansion 4mil, vias tented up to drill 25mil, thermal gap 10mil

### Footprints (pad centres in the part's own frame; a part is rotated, then mirrored left to right if it is on the bottom)
C0402 = smd 0.7 x 0.9: 1 -0.65,0; 2 0.65,0
0402-TIGHT = smd 0.6 x 0.6: 1 -0.5,0; 2 0.5,0
C1206 = smd 1.6 x 1.8: 1 -1.4,0; 2 1.4,0
CAPPM7343X400N = smd 2.3 x 2.35: 1 -3.15,0; 2 3.15,0
BOURNS_INC._CDSOT23-SM712_0 = smd 0.85 x 0.85: 1 -1,0.95; 2 -1,-0.95; 3 1,0
CD123DB140LR = smd 2.73 x 1.6: 1 -0.765,0 | smd 0.86 x 1.6: 2 1.7,0
SODFL4626X130N = smd 1.66 x 1.63: 1 -1.825,0; 2 1.825,0
SOT230P700X180-4N = smd 1.8 x 0.9: 1 -3,2.3; 2 -3,0; 3 -3,-2.3 | smd 1.8 x 3.2: 4 3,0
SOIC127P600X175-8N = smd 1.528 x 0.65: 1 -2.711,1.905; 2 -2.711,0.635; 3 -2.711,-0.635; 4 -2.711,-1.905; 5 2.711,-1.905; 6 2.711,-0.635; 7 2.711,0.635; 8 2.711,1.905
691214110002S = drill 1.3 pad 2: 1 0,0; 2 3.5,0
1751112 = drill 1.1 pad 1.65 square: 1 0,0 | drill 1.1 pad 1.65: 2 3.5,0; 3 7,0; 4 10.5,0
GCT_USB4110-GF-A_REVB = smd 0.6 x 1.15: A1/B12 -3.2,1.075; A4/B9 -2.4,1.075; B1/A12 3.2,1.075; B4/A9 2.4,1.075 | smd 0.3 x 1.15: A5 -1.25,1.075; A6 -0.25,1.075; A7 0.25,1.075; A8 1.25,1.075; B5 1.75,1.075; B6 0.75,1.075; B7 -0.75,1.075; B8 -1.75,1.075 | smd 2.18 x 2: S1 -5.11,0.5; S2 5.11,0.5; S3 -5.11,-3.43; S4 5.11,-3.43 | hole 0.65: -2.89,0; 2.89,0
XAL6060153MEC = smd 1.43 x 5.5: 1 -2.02,0; 2 2.02,0
SC70-6 = smd 0.3 x 0.66: 1 -0.65,-0.92; 2 0,-0.92; 3 0.65,-0.92; 4 0.65,0.92; 5 0,0.92; 6 -0.65,0.92
R0402 = smd 0.6 x 0.7: 1 -0.5,0; 2 0.5,0
R0603 = smd 1 x 1.1: 1 -0.85,0; 2 0.85,0
TACTILE_SWITCH_SMD_4.6X2.8MM = smd 0.9 x 1: 1 -2.05,-0.8; 2 2.05,-0.8; 3 2.05,0.8; 4 -2.05,0.8
SPRINTIR-6S-20 = drill 0.6: 1 7,0; 2 7,2; 3 -5,-0.5; 4 -5,-5
QFN50P700X700X80-49N = smd 0.86 x 0.27: 1 -3.435,2.75; 2 -3.435,2.25; 3 -3.435,1.75; 4 -3.435,1.25; 5 -3.435,0.75; 6 -3.435,0.25; 7 -3.435,-0.25; 8 -3.435,-0.75; 9 -3.435,-1.25; 10 -3.435,-1.75; 11 -3.435,-2.25; 12 -3.435,-2.75; 25 3.435,-2.75; 26 3.435,-2.25; 27 3.435,-1.75; 28 3.435,-1.25; 29 3.435,-0.75; 30 3.435,-0.25; 31 3.435,0.25; 32 3.435,0.75; 33 3.435,1.25; 34 3.435,1.75; 35 3.435,2.25; 36 3.435,2.75 | smd 0.27 x 0.86: 13 -2.75,-3.435; 14 -2.25,-3.435; 15 -1.75,-3.435; 16 -1.25,-3.435; 17 -0.75,-3.435; 18 -0.25,-3.435; 19 0.25,-3.435; 20 0.75,-3.435; 21 1.25,-3.435; 22 1.75,-3.435; 23 2.25,-3.435; 24 2.75,-3.435; 37 2.75,3.435; 38 2.25,3.435; 39 1.75,3.435; 40 1.25,3.435; 41 0.75,3.435; 42 0.25,3.435; 43 -0.25,3.435; 44 -0.75,3.435; 45 -1.25,3.435; 46 -1.75,3.435; 47 -2.25,3.435; 48 -2.75,3.435 | smd 5.5 x 5.5: 49 0,0
MODULE_ESP32-WROOM-32 = smd 2 x 0.9: 1 -8.5,5.26; 2 -8.5,3.99; 3 -8.5,2.72; 4 -8.5,1.45; 5 -8.5,0.18; 6 -8.5,-1.09; 7 -8.5,-2.36; 8 -8.5,-3.63; 9 -8.5,-4.9; 10 -8.5,-6.17; 11 -8.5,-7.44; 12 -8.5,-8.71; 13 -8.5,-9.98; 14 -8.5,-11.25; 25 8.5,-11.25; 26 8.5,-9.98; 27 8.5,-8.71; 28 8.5,-7.44; 29 8.5,-6.17; 30 8.5,-4.9; 31 8.5,-3.63; 32 8.5,-2.36; 33 8.5,-1.09; 34 8.5,0.18; 35 8.5,1.45; 36 8.5,2.72; 37 8.5,3.99; 38 8.5,5.26 | smd 0.9 x 2: 15 -5.715,-12.25; 16 -4.445,-12.25; 17 -3.175,-12.25; 18 -1.905,-12.25; 19 -0.635,-12.25; 20 0.635,-12.25; 21 1.905,-12.25; 22 3.175,-12.25; 23 4.445,-12.25; 24 5.715,-12.25 | smd 1.33 x 1.33: 39_1 -2.835,-0.405; 39_2 -1,-0.405; 39_3 0.835,-0.405; 39_4 -2.835,-2.24; 39_5 -1,-2.24; 39_6 0.835,-2.24; 39_7 -2.835,-4.075; 39_8 -1,-4.075; 39_9 0.835,-4.075 | drill 0.2 pad 0.3: 39_10 -1.917,-0.405; 39_11 -0.083,-0.405; 39_12 -2.835,-1.323; 39_13 -1,-1.323; 39_14 0.835,-1.323; 39_15 -1.917,-2.24; 39_16 -0.083,-2.24; 39_17 -2.835,-3.158; 39_18 -1,-3.158; 39_19 0.835,-3.158; 39_20 -1.917,-4.075; 39_21 -0.083,-4.075
CONV_TPS5450DDAR = smd 1.55 x 0.6: 1 -2.7,1.905; 2 -2.7,0.635; 3 -2.7,-0.635; 4 -2.7,-1.905; 5 2.7,-1.905; 6 2.7,-0.635; 7 2.7,0.635; 8 2.7,1.905 | smd 2.95 x 4.9: 9 0,0 | drill 0.2 pad 0.3: 10 -0.65,1.95; 11 0.65,1.95; 12 -0.65,0.65; 13 0.65,0.65; 14 -0.65,-0.65; 15 0.65,-0.65; 16 -0.65,-1.95; 17 0.65,-1.95
QFN24 = smd 0.85 x 0.3: 1 -2.05,1.25; 2 -2.05,0.75; 3 -2.05,0.25; 4 -2.05,-0.25; 5 -2.05,-0.75; 6 -2.05,-1.25; 13 2.05,-1.25; 14 2.05,-0.75; 15 2.05,-0.25; 16 2.05,0.25; 17 2.05,0.75; 18 2.05,1.25 | smd 0.3 x 0.85: 7 -1.25,-2.05; 8 -0.75,-2.05; 9 -0.25,-2.05; 10 0.25,-2.05; 11 0.75,-2.05; 12 1.25,-2.05; 19 1.25,2.05; 20 0.75,2.05; 21 0.25,2.05; 22 -0.25,2.05; 23 -0.75,2.05; 24 -1.25,2.05 | smd 2.55 x 2.55: PAD 0,0
OLED_0.96_I2C = drill 1 pad 1.778: GND -1.63,11.63; SCL 0.91,11.63; SDA 3.45,11.63; VCC -4.17,11.63 | hole 2: -10.67,-11.97; 10.03,-11.97; 10.03,11.33; -10.67,11.33
ABLS_SERIES_ABR = smd 4.318 x 1.016: 1 -4.699,0; 2 4.699,0

### Placement (x,y rotation side)
C1  39.83,54.93 90 top
C2  42.11,54.94 90 top
C3  41.01,54.93 90 top
C4  17.2,36.5 180 top
C5  27.6,8.5 270 top
C6  26.7,8.5 270 top
C7  15.7,30.1 270 top
C8  17.2,38.3 180 top
C9  88.2,61.2 180 top
C10  17.6,30.1 270 top
C11  16.7,30.1 270 top
C12  15.4,42.4 90 top
C13  31,42.4 90 top
C14  54.8,8.5 270 top
C15  55.7,8.5 270 top
C16  87.45,52.84 180 top
C17  82.4,8.5 270 top
C18  90.24,32.61 270 top
C19  92.27,32.58 270 top
C20  79.27,32.02 270 top
C21  73.17,36.34 0 top
C22  69.18,56.81 0 top
C23  75,49.71 0 top
C24  86.38,34.05 270 top
C25  88.53,40.12 0 top
C26  83.3,8.5 270 top
C27  85.3,8.5 270 top
C28  84.4,8.5 270 top
C29  87.4,53.9 180 top
D1  93.99,49.73 0 top
D2  75.01,53.08 0 top
D3  81.56,32.53 270 top
IC1  92.9,58.2 270 top
IC2  85.08,49.64 0 top
J3  107.61,34.05 270 top
J4  104.32,42.15 90 top
J7  79.97,58.26 180 top
L2  81.3,39.01 0 top
Q6  66.27,48.12 90 top
R1  82.88,52.9 0 top
R2  17.2,31.7 0 top
R3  66.57,46.23 180 top
R4  66.34,50 0 top
R5  17.2,37.4 0 top
R6  80.54,49.67 270 top
R7  75.41,55.36 180 top
R8  82.89,46.46 0 top
R9  89.59,49.67 90 top
R10  91.43,50.52 0 top
R11  91.42,48.84 0 top
R12  23.75,55.11 270 top
R13  26.41,55.06 270 top
R14  17.2,32.6 0 top
R15  17.2,34.4 0 top
R16  17.2,33.5 0 top
R19  78.23,54.88 90 top
R20  81.25,54.86 90 top
R21  69.87,30.88 90 top
R22  70.38,28.97 180 top
R23  71.08,52.36 270 top
R24  69.18,55.83 180 top
S1  69.13,60.02 90 top
SEN1  14,14 0 top
SEN2  42,14 0 top
SEN3  70,14 0 top
SEN4  98,14 0 top
U1  24.1,33.4 0 top
U2  53.19,50.46 0 top
U3  74.7,32.27 0 top
U4  70.99,48.52 180 top
U$15  22.84,48.21 0 top
Y1  23.1,41.9 0 top

### Tracks (layer width: path | path; a pad name or v marks a point on that pad's centre or on a via)
0  (via drill 0.35, 1 pad 2.03)
  Top 0.203: U2.25 v63.51,39.21 v63.52,39.2 63.52,36.08 v63.6,36 | v64.94,46.49 64.94,47.06 Q6.6
  Bottom 0.203: v64.94,46.49 64.94,40.84 63.52,39.42 v63.52,39.2
1_N
  Top 0.203: IC2.6 89.41,49.01 R9.1 90.9,48.82 R11.1
1_P
  Top 0.203: IC2.7 89.34,50.27 R9.2 R10.1
2_N
  Top 0.203: J4.1 104.32,43.15 arc45 104.3,43.2 104.08,43.42 arc45 103.05,43.84 100.07,43.84 arc-45 98.85,44.35 arc-45 98.5,45.19 98.5,48.86 arc45 98.4,49.1 arc45 97.38,49.52 96.17,49.52 95.4,48.75 93.02,48.75 D1.2 92.93,48.84 R11.2
  Bottom 0.203: J4.1 104.32,42.4 103,43.72 102.13,43.72 arc-45 101.1,44.15 arc-45 100.39,45.85 100.39,49.8 arc-45 100.85,50.91 101,51.05 arc-45 101.37,51.21 103.44,51.21 arc45 104.15,51.5 arc45 104.32,51.91 J4.4
2_P
  Top 0.203: J4.2 104.32,44.72 arc-45 104.25,44.55 arc-45 103.41,44.2 100.07,44.2 arc-45 99.1,44.6 arc-45 98.86,45.19 98.86,48.86 arc45 98.65,49.35 arc45 97.38,49.88 96.17,49.88 95.4,50.65 93.02,50.65 D1.1 92.09,50.68 R10.2
  Bottom 0.203: J4.2 104.32,45.4 103,44.08 102.13,44.08 arc-45 101.35,44.4 arc-45 100.75,45.85 100.75,46.72 arc-90 101.04,47.01 101.19,47.01 arc90 101.49,47.3 101.49,48.02 arc90 101.19,48.31 101.04,48.31 arc-90 100.75,48.6 100.75,49.8 arc-45 101.1,50.65 101.25,50.8 arc-45 101.37,50.85 103.1,50.85 arc-45 104.12,50.43 104.15,50.4 arc-45 104.32,49.99 J4.3
3.3V  (via drill 0.35)
  Top 0.203: U4.6 U4.5 | U4.6 74.44,49.77 C23.1 | U4.7 72.87,50.57 73.04,50.4 U4.6
  Top 0.254: U1.2 19.75,35.65 18.98,36.42 | C4.1 18.9,36.5 18.98,36.42 | U1.47 21.85,37.82 v21.98,37.95 | U1.43 23.85,37.87 v23.98,38 | 18.98,36.42 18.98,36.54 v19.2,36.77
  Top 0.305: U1.9 20.05,32.15 19.3,31.4
  Top 0.381: 19.3,31.4 18.5,30.6 C10.1 C11.1 C7.1 15.7,31.3 16.1,31.7 R2.1 R14.1
  Top 0.508: 84.83,51.51 84.83,47.07 84.22,46.46 R8.2 83.39,45.41 84.45,44.35 86.95,44.35 87.88,43.42 C25.1 | 84.83,51.51 84.83,52.26 84.19,52.9 R1.2 83.43,52.95 v83.43,53.78 | 84.83,51.51 87.76,51.51 IC2.8 87.95,51.7 C16.1 87.95,53.85 C29.1 87.9,54.63 88.47,55.2 IC1.4 IC1.2 | R24.1 69.61,55.76 69.61,53.28 70.03,52.86 R23.1 71.05,52.89 v71.05,53.9 | U2.2 42.12,54.45 C2.1 41.02,54.44 C3.1 C1.1 39.78,54.48 26.49,54.48 R13.2 23.8,54.56 R12.2 20.26,54.61 18.67,56.2 U$15.VCC | C23.1 74.5,50.67 v74.48,50.69 | SEN1.4 C6.1 C5.1 SEN2.4 C14.1 C15.1 SEN3.4 C17.1 C26.1 C28.1 C27.1 SEN4.4 | C7.1 15.65,30.65 v14.75,30.65
  Top 0.762: R21.2 v69.87,32.46 v69.88,32.47 v69.88,33.5
  Bottom 0.254: v23.98,38 22.03,38 v21.98,37.95 21.98,36.88 21.75,36.65 19.32,36.65 v19.2,36.77 14.47,36.77 | 14.47,36.77 14.28,36.77 14.15,36.9 | 14.15,36.45 14.47,36.77 | 14.47,36.77 14.19,37.05 14.15,37.05
  Bottom 0.508: v71.05,53.9 71.34,53.61 74.06,53.61 | v83.43,53.78 83.26,53.61 74.87,53.61 | 74.06,53.61 74.55,53.61 | 74.55,53.61 74.87,53.61 | 74.48,53.22 v74.48,50.69 | 74.48,53.22 74.48,53.54 74.55,53.61 | 74.87,53.61 74.48,53.22 | 74.48,53.22 74.45,53.22 74.06,53.61 | v69.88,32.47 69.88,31.58 68.95,30.65 v14.75,30.65 | v14.75,30.65 14.15,31.25 14.15,36.45 14.15,36.9 14.15,37.05 14.15,58.5 15.49,59.84 U$15.VCC | SEN1.4 15.95,9 14.75,10.2 v14.75,30.65
  other vias: 84.9,40 85.95,40 86,39.05 84.9,39 87.05,39.05
  pour Top (no thermals): 81.56,41.74 81.56,35.58 87.65,35.58 87.65,41.74
  pour Bottom: 69.2,31.2 69.2,36.2 71.2,38.2 81.4,38.2 84,40.8 87.2,40.8 87.6,40.4 87.6,38.2 86.2,36.8 71.6,36.8 70.4,35.6 70.4,31.2
5.0V  (via drill 0.35)
  Top 0.508: D2.1 73.26,54.06 v73.26,54.6 | v88.71,59.73 v88.7,59.74 C9.1 IC1.3
  Bottom 0.508: v73.26,54.6 73.32,54.66 87.37,54.66 88.71,56 v88.71,59.73
CHIP_PU
  Top 0.203: Q6.3 67.71,48.77 68.05,49.11 68.05,49.86 68.68,50.49 R24.2 C22.1 | C22.1 68.68,57.62 S1.4 S1.3 | C22.1 63.56,56.81 63.17,56.42 59.51,56.42 56.27,53.18 U2.3
CS
  Top 0.203: R15.2 19.1,34.4 19.35,34.15 U1.5
DIR_RS485  (via drill 0.35)
  Top 0.203: R6.2 80.72,49.01 IC2.3 83.86,49.01 v83.87,49.02 | U2.13 46.56,40.48 v46.58,40.46
  Bottom 0.203: v46.58,40.46 53.66,40.46 56.28,37.84 66.13,37.84 71.05,42.76 77.61,42.76 v83.87,49.02
DTR  (via drill 0.35)
  Top 0.203: Q6.1 67.19,46.35 R3.1 67.74,46.23 v68.03,46.52 | v71.77,45.42 71.74,45.45 U4.23
  Bottom 0.203: v68.03,46.52 69.13,45.42 v71.77,45.42
GND  (via drill 0.3, 0.35)
  Top 0.152: 76.23,31.64 76.16,31.64 75.52,32.27 74.83,32.27 | 74.83,32.27 U3.9 | 74.83,32.27 74.83,31.93 74.77,31.86 74.77,30.08 74.82,30.03
  Top 0.203: IC2.2 82.5,50.41 v83.84,50.41 | U1.46 22.35,35.3 22.45,35.2 | D1.3 94.02,49.73 v94,49.75
  Top 0.254: U4.2 71.74,47.77 U4.PAD | U1.10 22.4,31.65 v24.25,33.5 | v24.25,33.5 24.5,33.75 24.5,34 24.25,33.75 v24.25,33.5 | U1.49 22.75,34.75 v22,34.75 | U1.49 24.1,34.6 v24.25,34.75 | U1.49 24.2,33.5 v24.25,33.5 | U1.49 22.45,35.05 22.45,35.2 | C8.2 15.95,38.3 v15.75,38.5 | R5.1 15.85,37.4 v15.75,37.5
  Top 0.508: C23.2 76.34,49.71 v76.38,49.67 | IC2.2 80.78,50.27 R6.1
  Top 0.762: U3.6 76.23,31.64 | 74.7,32.23 U3.9 74.74,32.27
  other vias: 88.8,31.18 70.99,48.52 43.6,62 43.6,61 43.6,60 43.6,59 43.6,58 43.6,57 46.6,56.5 47.6,56.5 48.6,56.5 49.6,56.5 50.6,56.5 51.6,56.5 52.6,56.5 53.6,56.5 54.6,56.5 55.6,56.5 56.6,56.5 57.6,56.5 58.6,56.5 62.6,62 62.6,61 62.6,60 62.6,59 62.6,58 26.25,34.75 22,33.5 26.25,33.5
  pour Top (no thermals): 70.53,28.59 75.33,28.59 76.09,29.35 76.09,34.69 73.3,34.69 73.3,29.86 72.79,29.35 70.53,29.35
  pour Top (no thermals): 84.97,31.96 84.97,32.36 87.76,32.36 87.76,32.09 111.35,32.09 111.35,29.13 80.26,29.13 80.26,30.3 78.63,30.3 78.63,30.29 78.6,30.29 78.6,31.26 76.26,31.26 76.26,32.03
  pour Bottom (rank 2): -1,-4 -1,64 112,64 112,-4
  pour Top (rank 2): -1,-4 112,-4 112,64 -1,64
IRQ  (via drill 0.35)
  Top 0.203: R14.2 18.45,32.6 | 18.45,32.6 19,32.6 19.55,33.15 U1.7 | 18.45,32.6 18.46,32.61 v18.6,32.61 | v41.95,42.95 44.62,42.95 U2.11
  Bottom 0.203: v18.6,32.61 39.46,32.61 41.95,35.1 v41.95,42.95
N$1
  Top 0.203: C8.1 21,38.3 21.35,37.95 U1.48
N$2
  Top 0.203: U1.6 17.85,33.65 R16.2
N$3  (via drill 2.1)
  other vias: 4,59
N$4  (via drill 2.1)
  other vias: 4,4
N$5
  Top 0.203: R5.2 20.2,37.4 20.66,36.94 U1.1
N$6  (via drill 2.1)
  other vias: 108,4
N$7  (via drill 2.1)
  other vias: 108,59
N$10
  Top 0.203: U4.3 76.73,48.27 78.97,50.5 78.97,53.11 80.22,54.37 J7.A6 80.22,57.81 80.36,57.95 80.36,58.08 80.45,58.16 80.45,58.55 80.14,58.86 79.29,58.86 79,58.57 79,58.01 79.22,57.79 J7.B6
N$11  (via drill 0.35)
  Top 0.203: U4.4 76.73,48.77 78.56,50.6 78.56,53.25 79.72,54.41 J7.A7 v79.72,58.22 v79.73,58.23 | v81.85,58.29 81.13,58.29 80.72,57.88 J7.B7
  Bottom 0.203: v79.73,58.23 79.79,58.29 v81.85,58.29
N$12
  Top 0.203: J7.A5 81.22,55.39 R20.2
N$13
  Top 0.203: J7.B5 R19.2
N$14
  Top 0.508: U3.1 71.02,34.18 70.63,34.56 70.63,35.83 71.14,36.34 C21.1
N$15
  pour Top (no thermals): 76.48,33.8 78.13,33.8 78.13,35.32 80.41,35.32 80.41,33.16 82.57,33.16 82.57,35.07 81.17,35.07 81.17,41.7 77.62,41.7 77.62,37.1 73.17,37.1 73.17,35.7 76.48,35.7
N$16  (via drill 0.35)
  Top 0.508: R7.1 76.28,55.34 | 76.28,55.34 76.71,54.91 D2.2 | 76.28,55.34 76.75,55.34 77.57,56.16 J7.B4/A9 77.57,56.07 v77.52,56.02 | v82.4,55.99 82.4,57.16 J7.A4/B9
  Bottom 0.508: v82.4,55.99 82.38,56.02 v77.52,56.02
N$17
  Top 0.508: U3.4 R21.1 R22.2
N$18
  Top 0.203: Q6.5 65.82,48.12 66.07,47.87 R3.2
N$21
  Top 0.203: Q6.2 66.59,48.12 66.53,48.18 66.53,49.69 R4.2
N$23
  Top 0.203: U4.9 71.24,51.7 R23.2
N$24
  Top 0.203: U4.8 71.74,54.4 72.7,55.36 R7.2
RST  (via drill 0.35)
  Top 0.203: R2.2 v18.55,31.7 18.9,31.7 19.85,32.65 U1.8 | v42.7,41.7 44.64,41.7 U2.12
  Bottom 0.203: v18.55,31.7 39.9,31.7 42.7,34.5 v42.7,41.7
RTS
  Top 0.203: U4.19 69.74,45.9 69.44,45.6 64.49,45.6 64.1,45.99 64.1,48.48 64.39,48.77 Q6.4 65.35,49.51 R4.1
RX
  Top 0.203: U4.21 70.74,45.48 70.15,44.89 64.19,44.89 63.39,45.7 63.39,50.03 62.78,50.64 U2.34
RX_1
  Top 0.203: SEN1.1 22.4,14 23.85,15.45 U1.18
RX_2
  Top 0.203: U1.26 27.55,31.14 35.26,31.14 50.4,16 50.4,14.3 50.1,14 SEN2.1
RX_3
  Top 0.203: U1.34 31.73,35.15 33.09,33.8 35.1,33.8 44.95,23.96 58.45,23.96 63.46,18.94 76.66,18.84 78.1,17.4 78.1,14.4 77.7,14 SEN3.1
RX_4
  Top 0.203: U1.42 24.35,37.4 25.06,38.11 30.3,38.11 31.45,39.26 34.75,39.26 35.86,38.15 35.86,34.05 45.24,24.67 58.74,24.67 62.15,21.26 89.65,21.26 94.4,16.5 103.4,16.5 103.9,17 105.9,17 106.4,16.5 106.4,14.4 106,14 SEN4.1
RX_RS485
  Top 0.203: R1.1 IC2.1 80.11,51.55 79.5,50.94 79.5,47.85 74.23,42.58 63.58,42.58 63.14,43.02 U2.28
SCL  (via drill 0.35)
  Top 0.203: U$15.SCL R12.1 | U1.4 20.61,34.7 19.3,34.7 18.66,35.34 14.56,35.34 14.04,35.86 14.04,59 16.83,61.78 v23.8,61.78 | v58.52,53.12 58.58,53.18 U2.36
  Bottom 0.203: U$15.SCL 23.75,59.55 | 23.75,59.55 23.75,57.79 24.21,57.33 39.6,57.33 43.61,53.32 58.32,53.32 v58.52,53.12 | v23.8,61.78 23.8,59.6 23.75,59.55
SDA  (via drill 0.35)
  Top 0.203: R13.1 26.29,55.68 U$15.SDA 26.29,60.36 25.5,61.15 16.7,61.15 14.4,58.85 14.4,36.05 14.75,35.7 18.9,35.7 19.45,35.15 U1.3 | v59.8,49.46 61.5,49.46
  Top 0.508: U2.33 61.6,49.46 61.5,49.46
  Bottom 0.203: U$15.SDA 26.29,58.39 26.99,57.69 39.75,57.69 43.48,53.95 58.58,53.95 59.8,52.73 v59.8,49.46
TX
  Top 0.203: 62.52,51.91 U2.35 62.68,51.91 63.74,50.84 63.74,45.84 64.34,45.24 69.8,45.24 70.24,45.69 U4.20
TX_1
  Top 0.203: SEN1.2 22.8,16 23.35,16.55 U1.17
TX_2
  Top 0.203: U1.25 35.05,30.65 49,16.7 SEN2.2
TX_3
  Top 0.203: U1.33 31.68,34.65 32.94,33.4 35,33.4 44.8,23.6 58.3,23.6 63.5,18.4 74.6,18.4 SEN3.2
TX_4
  Top 0.203: U1.41 24.85,37.35 25.25,37.75 30.45,37.75 31.6,38.9 34.6,38.9 35.5,38 35.5,33.91 45.09,24.31 58.59,24.31 62.01,20.9 89.5,20.9 94.4,16 SEN4.2
TX_RS485
  Top 0.203: R8.1 82.37,46.48 IC2.4 79.89,47.73 74.38,42.22 63.54,42.22 63.07,41.75 U2.27
VIN  (via drill 0.35)
  Top 1.016: U3.7 78.76,32.91 79.27,33.42 v79.27,34.05
  Bottom 1.778: v79.27,34.05 v87.27,34.05
  other vias: 86.38,34.05 85.49,34.05 84.6,34.05
  pour Top (no thermals): 76.48,32.53 78.51,32.53 78.71,32.32 80.03,32.32 80.03,34.94 78.51,34.94 78.51,33.29 76.48,33.29
  pour Bottom (no thermals): 111.27,35.01 78.53,35.01 78.53,32.94 111.33,32.94
  pour Top (no thermals): 83.7,33 83.7,35 111.5,35 111.5,33
XIN
  Top 0.203: Y1.1 C12.1 15.4,39.9 16.05,39.25 22.05,39.25 22.85,38.45 U1.45
XOUT
  Top 0.203: Y1.2 C13.1 31,39.7 30.5,39.2 24.1,39.2 23.35,38.45 U1.44

### Text on the board
tPlace: B | A | A | B | VIN | GND